# Altium schematic sheet Power+ESP32.SchDoc
size A4; SheetNumber: 1; SheetTotal: 2
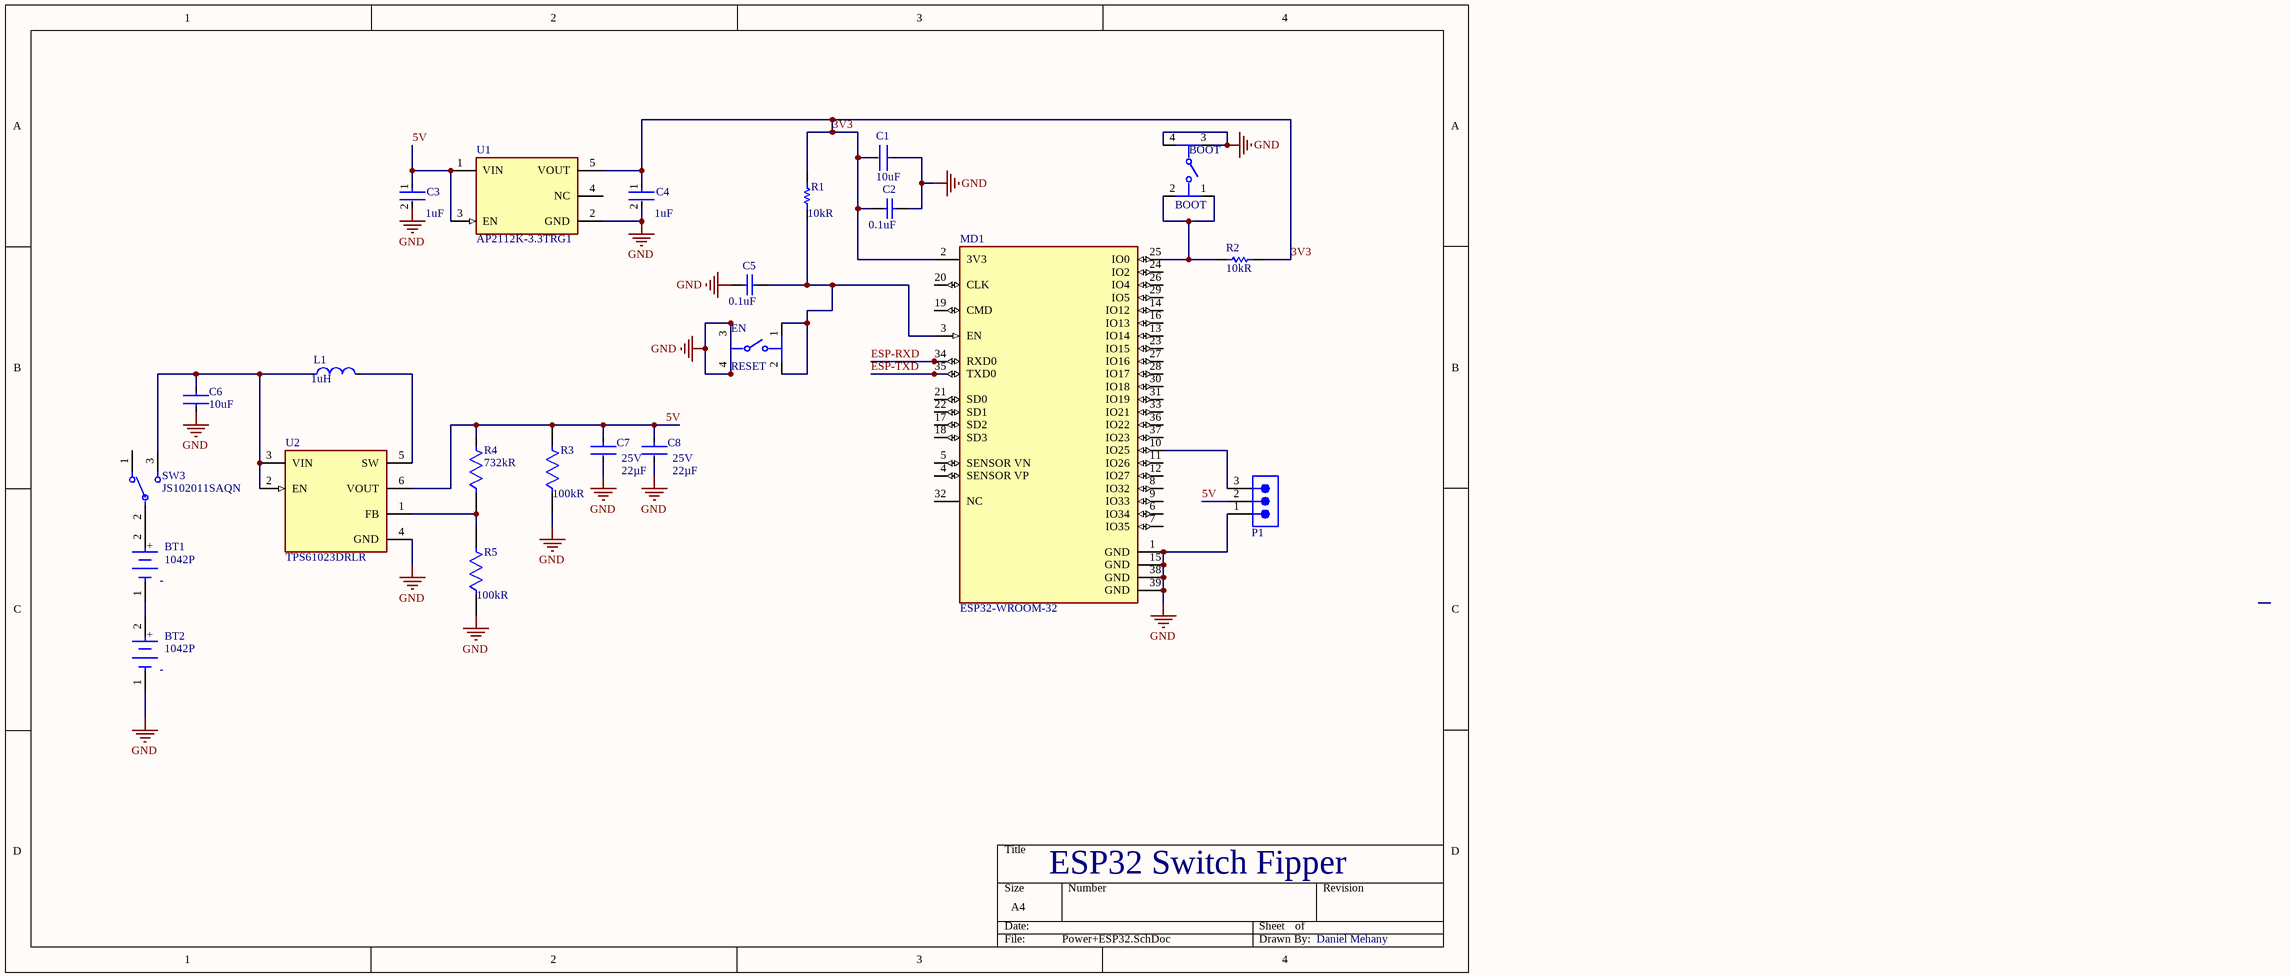
[diagram p0: Power+ESP32.SchDoc]

## Parts
BOOT  BOOT  [FP-PTS645SM43SMTR92LFS-MFG]
BT1  1042P  [FP-1042P-MFG]
BT2  1042P  [FP-1042P-MFG]
C1  value 10uF  [FP-CL31-IPC_C]  (hidden comment: CL31A106KBHNNNE)
C2  cap: 0.1uF  [CAPC1050X55X23ML05T13]  (hidden comment: CL05B104KO5NNNC)
C3  Capacitance: 1uF  [FP-CL31-IPC_B]  (hidden comment: CL31B105KBHNNNE)
C4  Capacitance: 1uF  [FP-CL31-IPC_B]  (hidden comment: CL31B105KBHNNNE)
C5  cap: 0.1uF  [CAPC1050X55X23ML05T13]  (hidden comment: CL05B104KO5NNNC)
C6  value 10uF  [FP-CL31-IPC_C]  (hidden comment: CL31A106KBHNNNE)
C7  CL31A226KAHNNNE  [CL31H-0_2_MFG]  (value not drawn)
C8  CL31A226KAHNNNE  [CL31H-0_2_MFG]  (value not drawn)
EN  RESET  [FP-PTS645SM43SMTR92LFS-MFG]
L1  value 1uH  [FP-XAL4020-102MEC-MFG]  (hidden comment: XAL4020-102MEC)
MD1  ESP32-WROOM-32  [FP-ESP32-WROOM-32-MFG]
P1  TSW-103-07-G-S  [SMTC-TSW-103-07-X-S]  (value not drawn)
R1  value 10kR  [RESC2013X60X35NL10T20]  (hidden comment: 0805W8F1002T5E)
R2  value 10kR  [RESC2013X60X35NL10T20]  (hidden comment: 0805W8F1002T5E)
R3  value 100kR  [FP-CRCW0603-HPe3-IPC_C]  (hidden comment: 0603WAF1003T5E)
R4  732kR  [FP-RC0603-0_55-IPC_A]
R5  value 100kR  [FP-CRCW0603-HPe3-IPC_C]  (hidden comment: 0603WAF1003T5E)
SW3  JS102011SAQN  [FP-JS102011SAQN-MFG]
U1  AP2112K-3.3TRG1  [FP-SOT25-IPC_A]
U2  TPS61023DRLR  [FP-DRL0006A-MFG]

## Nets
GND: BOOT.3 BOOT.4 BT2.1(C) C1.1 C2.2 C3.2 C4.2 C5.1 C6.2 C7.2 C8.2 EN.3 EN.4 MD1.1(GND) MD1.15(GND) MD1.38(GND) MD1.39(GND) P1.1 R3.1 R5.1 U1.2(GND) U2.4(GND)
3V3: C1.2 C2.1 C4.1 MD1.2(3V3) R1.2 R2.1 U1.5(VOUT)
5V: C3.1 C7.1 C8.1 P1.2 R3.2 R4.2 U1.1(VIN) U1.3(EN) U2.6(VOUT)
ESP-RXD: MD1.34(RXD0)
ESP-TXD: MD1.35(TXD0)
NetBOOT_1: BOOT.1 BOOT.2 MD1.25(IO0) R2.2
NetBT1_1: BT1.1(C) BT2.2(A)
NetBT1_2: BT1.2(A) SW3.2(C)
NetC5_2: C5.2 EN.1 EN.2 MD1.3(EN) R1.1
NetC6_1: C6.1 L1.1 SW3.3 U2.2(EN) U2.3(VIN)
NetL1_2: L1.2 U2.5(SW)
NetMD1_10: MD1.10(IO25) P1.3
NetR4_1: R4.1 R5.2 U2.1(FB)

Not connected (* = marked no-connect by the designer): MD1 4(SENSOR_VP) 5(SENSOR_VN) 6(IO34) 7(IO35) 8(IO32) 9(IO33) 11(IO26) 12(IO27) 13(IO14) 14(IO12) 16(IO13) 17(SD2) 18(SD3) 19(CMD) 20(CLK) 21(SD0) 22(SD1) 23(IO15) 24(IO2) 26(IO4) 27(IO16) 28(IO17) 29(IO5) 30(IO18) 31(IO19) 32(NC) 33(IO21) 36(IO22) 37(IO23); SW3 1; U1 4(NC)

## Notes on the sheet
- ESP32 Switch Fipper
- Daniel Mehany
- (in symbol CMP-19636-000019-1) +; -

## Library data of the parts
BOOT EN = CMP-2000-05160-2: SWITCH TACTILE SPST-NO 0.05A 12V; Contact Resistance: 100mR; Throw Configuration: SPST; Illumination Type: Non-Illuminated; Mechanical Life: 100000Cycles; Current Rating: 50mA; Switch Function: Off-Mom; Actuator Length: 0.85mm; Actuator Material: Nylon; Actuator Type: Standard; Operating Force: 160gf; Min Operating Temperature: -20°C; REACH SVHC: No SVHC; Termination: Gull Wing; Case/Package: SMD/SMT; Packaging: Tape and Reel; Mount: Surface Mount; Voltage Rating (DC): 12V; Orientation: Straight; Lead Free: Lead Free; Contact Material: Silver; Color: Black; Max Current Rating: 50mA; Contact Plating: Silver; Depth: 9mm; Package Quantity: 1; Max Voltage Rating (DC): 12V; Length: 6mm; Max Operating Temperature: 60°C; JLCPCB Part #: C221880
BT1 BT2 = CMP-19636-000019-1: BATTERY HOLDER 18650 SMD TAB; Number of Cells: 1; Max Operating Temperature: 145°C; Termination: SMD/SMT; Mount: Surface Mount; Min Operating Temperature: -50°C; Package Quantity: 200; Packaging: Tray; Lead Free: Lead Free; JLCPCB Part #: C6038009
C1 C6 = CMP-13271-000016-1: CAP CER 10UF 50V X5R 1206; Manufacturer: Samsung; Tolerance: 10%; Material: Ceramic; Temperature Coefficient: 15%; RoHS: TRUE; Ipc Land Pattern Name: CAPC320160X160; Temperature Range Low: -55°C; Device Class L3: Ceramic Capacitors; Category: Cap; Temperature Characteristic: X5R; Lead Free: Yes; Device Class L2: Capacitors; Octopart: https://octopart.com/cl31a106kbhnnne-samsung-19832778; ComponentLink2Description: Datasheet; Digikey Description: CAP CER 10UF 50V X5R 1206; Voltage: 50V; ComponentLink2URL: http://www.samsungsem.com/kr/support/product-search/mlcc/__icsFiles/afieldfile/2018/06/21/CL31A106KBHNNNE.pdf; Capacitance: 10uF; Manufacturer Part Number: CL31A106KBHNNNE; Temperature Range High: +85°C; Device Class L1: Passive Components; Height: 1.8mm; Automotive: No; Voltage Rating: 50V; Package: CL31; Temperature: -55°C to +85°C; JLCPCB Part #: C13585
C2 C5 = CMP-2000-05439-1: Chip Capacitor, 100 nF, +/- 10%, 16 V, -55 to 125 degC, 0402 (1005 Metric), RoHS, Tape and Reel; Manufacturer: Samsung Electro-Mechanics; Capacitance: 100000pF; Dielectric: X7R; Rated Voltage: 16V; Case Size/Dimension: 0402; Tolerance (%): ±10%; Manufacturer URL: http://www.samsungsem.com/global/index.jsp; Datasheet URL: https://datasheet.ciiva.com/29198/458718-da-01-en-vs-kondensator-0402-29198423.pdf; Datasheet Version: Nov-10; JLCPCB Part #: C1525
C3 C4 = CMP-13271-001662-1: Cap Ceramic 1uF 50V X7R ±10% SMD 1206 +125°C Embossed T/R; Case Code (Metric): 3216; Packaging: Tape and Reel; Depth: 1.6mm; Max Operating Temperature: 125°C; Length: 3.2mm; Contact Plating: Tin; Voltage Rating (DC): 50V; Radiation Hardening: No; Min Operating Temperature: -55°C; Dielectric: X7R; Voltage: 50V; Lead Free: Lead Free; Package Quantity: 1; Material: Ceramic; Thickness: 0.071inch; Width: 0.063inch; Voltage Rating: 50V; Case Code (Imperial): 1206; Mount: Surface Mount; Case/Package: 1206; Tolerance: 10%; Height: 1.6mm; JLCPCB Part #: C1848
C7 C8 = CMP-13271-000012-2: Ceramic Capacitor, Multilayer, Ceramic, 25V, 10% +Tol, 10% -Tol, X5R, 15% TC, 22uF, Surface Mount, 1206; Capacitance: 22µF; Material: Ceramic; RoHS: Compliant; Dielectric: X5R; HelpURL: https://product.samsungsem.com/mlcc/CL31A226KAHNNN.do; Max Operating Temperature: 85°C; Tolerance: 10%; Voltage Rating (DC): 25V; ComponentLink2Description: Datasheet URL; Voltage Rating: 25V; Min Operating Temperature: -55°C; ComponentLink2URL: https://product.samsungsem.com/mlcc/CL31A226KAHNNN.do; Case/Package: 1206; Height: 1.8mm; JLCPCB Part #: C12891
L1 = CMP-11268-000037-1: Fixed Inductors 1uH 20% 9.6A 14.60mOhms AEC-Q200; Manufacturer: Coilcraft; Saturation Current: 8.7A; Core Material: Composite; Test Frequency: 1MHz; Standoff Height: 0.1mm; Shielding: true; Automotive Grade: Grade 1; Self Resonant Frequency: 79MHz; Series Resistance: 14.6mΩ; Rms Current: 9.6A; Category: Ind; RoHS: TRUE; Device Class L2: Inductors; Mouser Description: Power inductor, shielded, 20% tol, SMT, RoHS, halogen f; Lead Free: Yes; Device Class L1: Passive Components; Inductance: 1uH; ComponentLink2URL: https://www.coilcraft.com/pdfs/xal4000.pdf; Height: 2.1mm; Device Class L3: Fixed Inductors; Composition: Wirewound; Package: 0; Ambient Temperature Range Low: -40°C; Automotive: Yes; Ambient Temperature Range High: +125°C; ComponentLink2Description: Datasheet; Octopart: https://octopart.com/xal4020-102mec-coilcraft-13142161; Tolerance: 20%; Manufacturer Part Number: XAL4020-102MEC; JLCPCB Part #: C4555951
MD1 = CMP-194065-000008-1: RX TXRX MOD WIFI SURFACE MOUNT; Frequency: 2.5GHz; Sensitivity: -98dBm; Operating Supply Voltage: 3.6V; Data Rate: 150Mbps; Weight: 0.088185oz; Package Quantity: 550; Min Operating Temperature: -40°C; Mount: Surface Mount; Max Operating Temperature: 85°C; Packaging: Cut Tape; Case/Package: SMD/SMT; JLCPCB Part #: C82899
P1 = CMP-1024-00333-1: 0.025" SQ Post Header, Through-hole, Vertical, -55 to 125 degC, 2.54 mm Pitch, 3-Pin, Male, RoHS; Manufacturer: Samtec; Pitch: 2.54 mm; ComponentLink3URL: http://www.samtec.com/documents/webfiles/cpdf/TSW-XXX-XX-XXX-X-XX-XXX-MKT.pdf; Temperature Range: -55 to 125 degC; DatasheetVersion: F-214; ComponentLink1Description: Manufacturer URL; ComponentLink2URL: http://www.samtec.com/documents/webfiles/pdf/TSW_TH.PDF; RoHS: True; Orientation: Vertical; ComponentLink2Description: Datasheet; ComponentLink3Description: Package Specification; PackageDescription: .025[0.64] SQ. Post Terminal Strip Assembly; Mounting Technology: Through-hole; PackageVersion: DM, 8/1988; ComponentLink1URL: http://www.samtec.com; PackageReference: TSW-103-07-X-S; PartNumber: TSW-103-07-G-S; JLCPCB Part #: C3335811
R1 R2 = CMP-1659-00013-4: RES 10kΩ 1% 0.125W 0805; Manufacturer: Uniroyal; Voltage Rating: 150 V; Mount: Surface Mount; Pins: 2; Length: 2 mm; Min Operating Temperature: -55 degC; Height: 0.5 mm; Mounting Technology: Surface Mount; RoHSCompliant: true; REACH SVHC: No SVHC; Max Operating Temperature: 155 degC; PackageReference: 0805; DatasheetVersion: Rev. 4, 02/2016; Package Quantity: 5000; Packaging: Tape and Reel; PackageDescription: 2-Pin Surface Mounted Device, Body 2 x 1.25 mm; JLCPCB Part #: C17414
  R1: MPN: 0805W8F1002T5E
  R2: Manufacturer Part Number: 0805W8F1002T5E
R3 R5 = CMP-02407-007815-1: RES Thick Film, 100kΩ, 1%, 0.33W, 100ppm/°C, 0603; Manufacturer: Uniroyal; Power Rating: 250mW; Voltage Rating: 75V; Min Operating Temperature: -55°C; Case/Package: 0603; Composition: Thick Film; Military Standard: Not; Temperature Coefficient: 100ppm/°C; Lead Free: Lead Free; Weight: 7.1E-05oz; Contact Plating: Tin; Width: 0.8mm; Length: 1.6mm; Radiation Hardening: No; Tolerance: 1%; Case Code (Metric): 1608; Features: Automotive AEC-Q200; Packaging: Tape and Reel; Max Power Dissipation: 250mW; Voltage Rating (DC): 75V; Resistance: 100kR; Height: 0.45mm; Case Code (Imperial): 0603; Number of Terminations: 2; Depth: 0.85mm; Max Operating Temperature: 155°C; Package Quantity: 10; Termination: SMD/SMT; Manufacturer Part Number: 0603WAF1003T5E; JLCPCB Part #: C25803
R4 = CMP-2000-04127-2: RES SMD 732K OHM 1% 1/10W 0603; Temperature Coefficient: 100ppm/°C; Voltage Rating: 50V; Power Rating: 100mW; Features: Moisture Resistant; Case Code (Imperial): 0603; Series: RC; Military Standard: Not; Termination: SMD/SMT; Size Code: 0603; Depth: 0.8mm; Length: 1.6mm; Number of Terminations: 2; Case/Package: 0603; Height: 0.45mm; Construction: Rectangular; Resistor Type: Thick Film; Max Power Dissipation: 100mW; Case Code (Metric): 1608; Voltage Rating (DC): 50V; Width: 0.8mm; Tolerance: 1%; Lead Free: Lead Free; value: 732kR; Packaging: Tape and Reel; Max Operating Temperature: 155°C; Min Operating Temperature: -55°C; RoHS Compliant: Yes; JLCPCB Part #: C23239
SW3 = CMP-2000-06501-2: SWITCH SLIDE SPDT 300MA 6V; Switch Function: On-On; Illumination Type: Non-Illuminated; Switch Travel: 2mm; Contact Resistance: 70mR; Actuator Material: Nylon; Electrical Life: 5000Cycles; Actuator Type: Standard; Max Operating Temperature: 85°C; Housing Material: Nylon; Radiation Hardening: No; Max Voltage Rating (DC): 6V; Package Quantity: 1; Case/Package: 100; Actuator Length: 2mm; Min Operating Temperature: -40°C; Contact Current Rating: 300mA; REACH SVHC: No SVHC; Throw Configuration: SPDT; Packaging: Tape and Reel; Contact Material: Copper Alloy; Max Current Rating: 300mA; Current Rating: 300mA; Mount: Surface Mount; Lead Free: Lead Free; Termination: Gull Wing; Voltage Rating (DC): 6V; Length: 9mm; Orientation: Right Angle; Contact Plating: Silver; JLCPCB Part #: C221660
U1 = CMP-12756-000035-1: IC REG LINEAR 3.3V 600MA SOT25; Number of Regulators: 1; Output Type: Fixed; Polarity: Positive; Min Input Voltage: 2.5V; Max Input Voltage: 6V; Accuracy: 1.5%; Quiescent Current: 55uA; Dropout Voltage: 250mV; Min Operating Temperature: -40°C; Length: 3.1mm; Output Current: 600mA; Max Operating Temperature: 85°C; Package Quantity: 1; Output Voltage: 3.3V; Width: 1.7mm; Number of Outputs: 1; Packaging: Tape and Reel; Height: 1.3mm; Lead Free: Lead Free; Max Output Current: 600mA; Case/Package: SOT-23-5; Mount: Surface Mount; Number of Pins: 5; JLCPCB Part #: C51118
U2 = CMP-04918-000638-1: FINISH GOODS FOR TPS61023; JLCPCB Part #: C919459